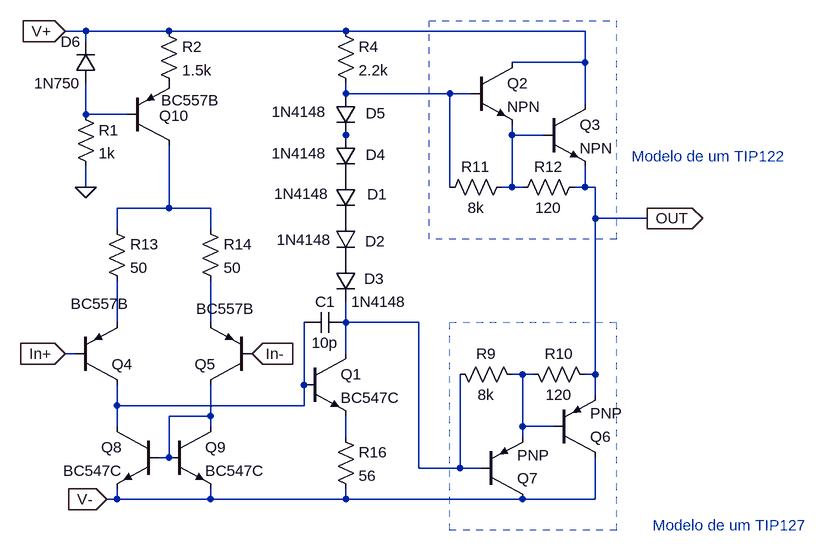
[diagram p0: schematic C_Fonte1.asc]
C_Fonte1.asc, the LTspice schematic file:
Version 4.1
SHEET 1 1376 680
WIRE -80 -336 -112 -336
WIRE 48 -336 -80 -336
WIRE 320 -336 48 -336
WIRE 688 -336 320 -336
WIRE -80 -320 -80 -336
WIRE 688 -288 688 -336
WIRE 688 -288 576 -288
WIRE 320 -240 320 -256
WIRE 480 -240 320 -240
WIRE 512 -240 480 -240
WIRE 688 -224 688 -288
WIRE -80 -208 -80 -256
WIRE -16 -208 -80 -208
WIRE 320 -176 320 -192
WIRE 576 -176 576 -192
WIRE 624 -176 576 -176
WIRE -80 -96 -80 -128
WIRE 480 -96 480 -240
WIRE 576 -96 576 -176
WIRE 576 -96 560 -96
WIRE 592 -96 576 -96
WIRE 688 -96 688 -128
WIRE 688 -96 672 -96
WIRE 704 -96 688 -96
WIRE 48 -64 48 -160
WIRE 48 -64 -32 -64
WIRE 112 -64 48 -64
WIRE 704 -48 704 -96
WIRE 784 -48 704 -48
WIRE -32 -32 -32 -64
WIRE 112 -32 112 -64
WIRE -32 112 -32 48
WIRE 112 112 112 48
WIRE 320 112 320 80
WIRE 432 112 320 112
WIRE -96 160 -112 160
WIRE 320 160 320 112
WIRE 592 192 576 192
WIRE 608 192 592 192
WIRE 704 192 704 -48
WIRE 704 192 688 192
WIRE 256 208 256 112
WIRE 704 224 704 192
WIRE -32 240 -32 208
WIRE 256 240 256 208
WIRE 256 240 -32 240
WIRE 112 256 112 208
WIRE 112 256 48 256
WIRE -32 272 -32 240
WIRE 112 272 112 256
WIRE 592 272 592 192
WIRE 640 272 592 272
WIRE 320 288 320 256
WIRE 592 288 592 272
WIRE 48 320 48 256
WIRE 48 320 32 320
WIRE 432 336 432 112
WIRE 496 336 496 192
WIRE 496 336 432 336
WIRE 528 336 496 336
WIRE -32 384 -32 368
WIRE -32 384 -48 384
WIRE 112 384 112 368
WIRE 112 384 -32 384
WIRE 320 384 320 368
WIRE 320 384 112 384
WIRE 592 384 320 384
WIRE 704 384 704 320
WIRE 704 384 592 384
FLAG -112 -336 V+
IOPIN -112 -336 In
FLAG -48 384 V-
IOPIN -48 384 In
FLAG -112 160 In+
IOPIN -112 160 In
FLAG 176 160 In-
IOPIN 176 160 In
FLAG 784 -48 OUT
IOPIN 784 -48 Out
FLAG -80 -96 0
SYMBOL pnp -96 208 M180
WINDOW 3 -7 125 Left 2
SYMATTR Value BC557B
SYMATTR InstName Q4
SYMBOL pnp 176 208 R180
WINDOW 3 -3 117 Left 2
SYMATTR Value BC557B
SYMATTR InstName Q5
SYMBOL res 304 -352 R0
SYMATTR InstName R4
SYMATTR Value 2.2k
SYMBOL res 480 176 M90
WINDOW 0 0 56 VBottom 2
WINDOW 3 32 56 VTop 2
SYMATTR InstName R9
SYMATTR Value 8k
SYMBOL res 592 176 M90
WINDOW 0 0 56 VBottom 2
WINDOW 3 32 56 VTop 2
SYMATTR InstName R10
SYMATTR Value 120
SYMBOL npn 512 -288 R0
SYMATTR InstName Q2
SYMBOL npn 624 -224 R0
SYMATTR InstName Q3
SYMBOL res 464 -80 R270
WINDOW 0 32 56 VTop 2
WINDOW 3 0 56 VBottom 2
SYMATTR InstName R11
SYMATTR Value 8k
SYMBOL res 576 -80 R270
WINDOW 0 32 56 VTop 2
WINDOW 3 0 56 VBottom 2
SYMATTR InstName R12
SYMATTR Value 120
SYMBOL pnp 640 320 M180
SYMATTR InstName Q6
SYMBOL pnp 528 384 M180
SYMATTR InstName Q7
SYMBOL npn 256 160 R0
SYMATTR InstName Q1
SYMATTR Value BC547C
SYMBOL cap 320 96 R90
WINDOW 0 0 32 VBottom 2
WINDOW 3 32 32 VTop 2
SYMATTR InstName C1
SYMATTR Value 10p
SYMBOL diode 304 -112 R0
WINDOW 0 49 27 Left 2
WINDOW 3 -94 26 Left 2
SYMATTR InstName D1
SYMATTR Value 1N4148
SYMBOL diode 304 -48 R0
WINDOW 0 46 35 Left 2
WINDOW 3 -90 33 Left 2
SYMATTR InstName D2
SYMATTR Value 1N4148
SYMBOL diode 304 16 R0
WINDOW 0 44 29 Left 2
SYMATTR InstName D3
SYMATTR Value 1N4148
SYMBOL diode 304 -176 R0
WINDOW 0 47 30 Left 2
WINDOW 3 -98 28 Left 2
SYMATTR InstName D4
SYMATTR Value 1N4148
SYMBOL diode 304 -240 R0
WINDOW 0 47 30 Left 2
WINDOW 3 -98 28 Left 2
SYMATTR InstName D5
SYMATTR Value 1N4148
SYMBOL res -48 -48 R0
SYMATTR InstName R13
SYMATTR Value 50
SYMBOL res 96 -48 R0
SYMATTR InstName R14
SYMATTR Value 50
SYMBOL res 304 272 R0
SYMATTR InstName R16
SYMATTR Value 56
SYMBOL npn 32 272 M0
SYMATTR InstName Q8
SYMATTR Value BC547C
SYMBOL npn 48 272 R0
SYMATTR InstName Q9
SYMATTR Value BC547C
SYMBOL diode -64 -256 R180
WINDOW 0 24 64 Left 2
WINDOW 3 24 0 Left 2
SYMATTR InstName D6
SYMATTR Value 1N750
SYMBOL res -96 -224 R0
SYMATTR InstName R1
SYMATTR Value 1k
SYMBOL pnp -16 -160 M180
WINDOW 3 52 70 Left 2
WINDOW 0 49 46 Left 2
SYMATTR Value BC557B
SYMATTR InstName Q10
SYMBOL res 32 -352 R0
SYMATTR InstName R2
SYMATTR Value 1.5k
TEXT 760 -144 Left 2 ;Modelo de um TIP122
TEXT 792 424 Left 2 ;Modelo de um TIP127
RECTANGLE Normal 736 -16 448 -352 2
RECTANGLE Normal 736 432 480 112 2

The netlist it stands for:
* C_Fonte1.asc
Q4 N010 In+ N006 0 BC557B
Q5 N011 In- N007 0 BC557B
R4 V+ N001 2.2k
R9 N008 N009 8k
R10 N009 OUT 120
Q2 V+ N001 N004 0 NPN
Q3 V+ N004 OUT 0 NPN
R11 N001 N004 8k
R12 N004 OUT 120
Q6 V- N009 OUT 0 PNP
Q7 V- N008 N009 0 PNP
Q1 N008 N010 N012 0 BC547C
C1 N008 N010 10p
D1 P001 P002 1N4148
D2 P002 P003 1N4148
D3 P003 N008 1N4148
D4 N003 P001 1N4148
D5 N001 N003 1N4148
R13 N005 N006 50
R14 N005 N007 50
R16 N012 V- 56
Q8 N010 N011 V- 0 BC547C
Q9 N011 N011 V- 0 BC547C
D6 N002 V+ 1N750
R1 N002 0 1k
Q10 N005 N002 P004 0 BC557B
R2 V+ P004 1.5k
.model D D
.lib standard.dio
.model NPN NPN
.model PNP PNP
.lib standard.bjt
* Modelo de um TIP122
* Modelo de um TIP127
.backanno
.end